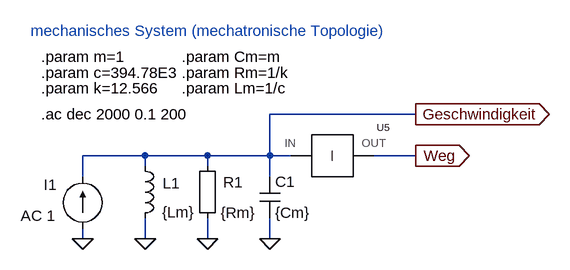
[diagram p0: schematic Isomorph_2.asc]
Isomorph_2.asc, the LTspice schematic file:
Version 4
SHEET 1 880 680
WIRE 448 -400 224 -400
WIRE 32 -336 -64 -336
WIRE 128 -336 32 -336
WIRE 224 -336 224 -400
WIRE 224 -336 128 -336
WIRE 256 -336 224 -336
WIRE 448 -336 384 -336
WIRE 32 -320 32 -336
WIRE 128 -320 128 -336
WIRE -64 -304 -64 -336
WIRE 224 -304 224 -336
WIRE -64 -208 -64 -224
WIRE 32 -208 32 -240
WIRE 128 -208 128 -240
WIRE 224 -208 224 -240
FLAG 32 -208 0
FLAG 128 -208 0
FLAG 224 -208 0
FLAG -64 -208 0
FLAG 448 -336 Weg
IOPIN 448 -336 Out
FLAG 448 -400 Geschwindigkeit
IOPIN 448 -400 Out
SYMBOL current -64 -224 R180
WINDOW 0 40 67 Left 2
WINDOW 3 24 0 Invisible 2
WINDOW 123 42 20 Left 2
WINDOW 39 0 0 Left 0
SYMATTR InstName I1
SYMATTR Value 1
SYMATTR Value2 AC 1
SYMBOL Mechatronik\\Control\\I-Glied 320 -336 R0
SYMATTR SpiceLine ic=0
SYMATTR InstName U5
SYMBOL cap 208 -304 R0
SYMATTR InstName C1
SYMATTR Value {Cm}
SYMBOL Misc\\EuropeanResistor 112 -336 R0
WINDOW 0 40 41 Left 2
WINDOW 3 36 88 Left 2
SYMATTR InstName R1
SYMATTR Value {Rm}
SYMBOL ind 16 -336 R0
WINDOW 0 43 42 Left 2
WINDOW 3 42 87 Left 2
SYMATTR InstName L1
SYMATTR Value {Lm}
SYMATTR SpiceLine Rser=0
TEXT -128 -400 Left 2 !.ac dec 2000 0.1 200
TEXT -144 -528 Left 2 ;mechanisches System (mechatronische Topologie)
TEXT 88 -488 Left 2 !.param Cm=m
TEXT 88 -464 Left 2 !.param Rm=1/k
TEXT 88 -440 Left 2 !.param Lm=1/c
TEXT -128 -464 Left 2 !.param c=394.78E3
TEXT -128 -440 Left 2 !.param k=12.566
TEXT -128 -488 Left 2 !.param m=1

The netlist it stands for:
* Isomorph_2.asc
I1 0 Geschwindigkeit 1 AC 1
XU5 Geschwindigkeit Weg I-Glied ic=0  ; pins IN OUT
C1 Geschwindigkeit 0 {Cm}
R1 Geschwindigkeit 0 {Rm}
L1 Geschwindigkeit 0 {Lm} Rser=0
.ac dec 2000 0.1 200
* mechanisches System (mechatronische Topologie)
.param Cm=m
.param Rm=1/k
.param Lm=1/c
.param c=394.78E3
.param k=12.566
.param m=1
.lib Control.lib
.backanno
.end